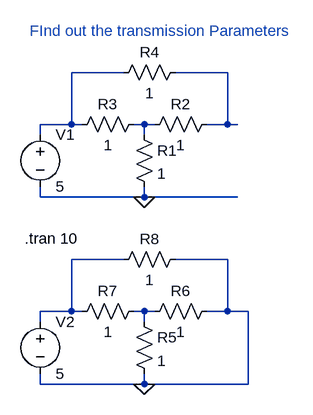
[diagram p0: schematic Lab7_ques4.asc]
Lab7_ques4.asc, the LTspice schematic file:
Version 4
SHEET 1 880 688
WIRE 144 192 64 192
WIRE 304 192 224 192
WIRE 64 272 64 192
WIRE 64 272 16 272
WIRE 80 272 64 272
WIRE 176 272 160 272
WIRE 192 272 176 272
WIRE 304 272 304 192
WIRE 304 272 272 272
WIRE 320 272 304 272
WIRE 16 288 16 272
WIRE 176 288 176 272
WIRE 16 384 16 368
WIRE 176 384 176 368
WIRE 176 384 16 384
WIRE 320 384 176 384
WIRE 144 480 64 480
WIRE 304 480 224 480
WIRE 64 560 64 480
WIRE 64 560 16 560
WIRE 80 560 64 560
WIRE 176 560 160 560
WIRE 192 560 176 560
WIRE 304 560 304 480
WIRE 304 560 272 560
WIRE 336 560 304 560
WIRE 16 576 16 560
WIRE 176 576 176 560
WIRE 16 672 16 656
WIRE 176 672 176 656
WIRE 176 672 16 672
WIRE 336 672 336 560
WIRE 336 672 176 672
FLAG 176 384 0
FLAG 176 672 0
SYMBOL Res 160 272 R0
SYMATTR InstName R1
SYMATTR Value 1
SYMBOL Res 288 256 R90
WINDOW 0 0 56 VBottom 2
WINDOW 3 32 56 VTop 2
SYMATTR InstName R2
SYMATTR Value 1
SYMBOL Res 176 256 R90
WINDOW 0 0 56 VBottom 2
WINDOW 3 32 56 VTop 2
SYMATTR InstName R3
SYMATTR Value 1
SYMBOL Res 240 176 R90
WINDOW 0 0 56 VBottom 2
WINDOW 3 32 56 VTop 2
SYMATTR InstName R4
SYMATTR Value 1
SYMBOL Voltage 16 272 R0
SYMATTR InstName V1
SYMATTR Value 5
SYMBOL Res 160 560 R0
SYMATTR InstName R5
SYMATTR Value 1
SYMBOL Res 288 544 R90
WINDOW 0 0 56 VBottom 2
WINDOW 3 32 56 VTop 2
SYMATTR InstName R6
SYMATTR Value 1
SYMBOL Res 176 544 R90
WINDOW 0 0 56 VBottom 2
WINDOW 3 32 56 VTop 2
SYMATTR InstName R7
SYMATTR Value 1
SYMBOL Res 240 464 R90
WINDOW 0 0 56 VBottom 2
WINDOW 3 32 56 VTop 2
SYMATTR InstName R8
SYMATTR Value 1
SYMBOL Voltage 16 560 R0
SYMATTR InstName V2
SYMATTR Value 5
TEXT -8 448 Left 2 !.tran 10
TEXT 0 128 Left 2 ;FInd out the transmission Parameters

The netlist it stands for:
* Lab7_ques4.asc
R1 N003 0 1
R2 N002 N003 1
R3 N003 N001 1
R4 N002 N001 1
V1 N001 0 5
R5 N005 0 1
R6 0 N005 1
R7 N005 N004 1
R8 0 N004 1
V2 N004 0 5
.tran 10
* FInd out the transmission Parameters
.backanno
.end